# Altium schematic sheet Sheet1.SchDoc
size A; SheetNumber: 1; SheetTotal: 1
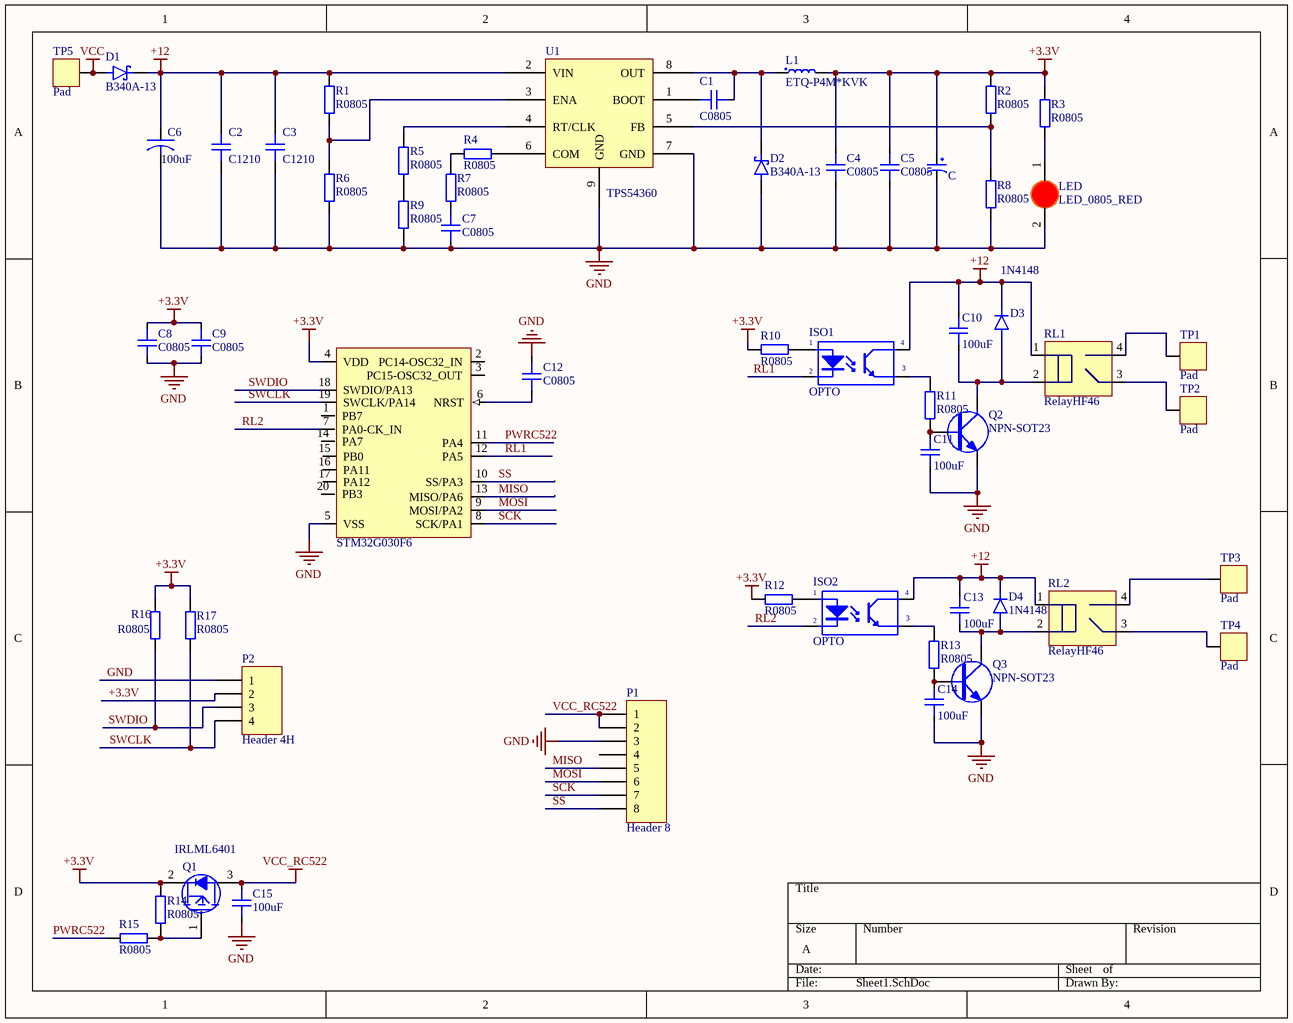
[diagram p0: Sheet1.SchDoc]

## Parts
?  STM32G030F6  [SOP65P640X120-20N]
C1  C0805  [CAP_0805]
C2  C1210  [CAP_1210]
C3  C1210  [CAP_1210]
C4  C0805  [CAP_0805]
C5  C0805  [CAP_0805]
C6  100uF  [TU HOA 1000uF/25V,50V]
C7  C0805  [CAP_0805]
C8  C0805  [CAP_0805]
C9  C0805  [CAP_0805]
C10  100uF  [CAP_0805]
C11  100uF  [CAP_0805]
C12  C0805  [CAP_0805]
C13  100uF  [CAP_0805]
C14  100uF  [CAP_0805]
C15  100uF  [CAP_0805]
D1  B340A-13  [B340A]
D2  B340A-13  [B340A]
D3  1N4148  [DIODE SMA 1]
D4  1N4148  [DIODE SMA 1]
ISO1  OPTO  [PC817 SMD]
ISO2  OPTO  [PC817 SMD]
L1  ETQ-P4M*KVK  [ind 7x7x4]
LED  LED_0805_RED  [LED-0805-Red]
P1  Header 8  [HDR1X8]
P2  Header 4H  [HDR1X4]
Q1  IRLML6401  [SOT23 - 3PIN]
Q2  NPN-SOT23  [SOT23 - 3PIN]
Q3  NPN-SOT23  [SOT23 - 3PIN]
R1  R0805  [RES_0805]
R2  R0805  [RES_0805]
R3  R0805  [RES_0805]
R4  R0805  [RES_0805]
R5  R0805  [RES_0805]
R6  R0805  [RES_0805]
R7  R0805  [RES_0805]
R8  R0805  [RES_0805]
R9  R0805  [RES_0805]
R10  R0805  [RES_0805]
R11  R0805  [RES_0805]
R12  R0805  [RES_0805]
R13  R0805  [RES_0805]
R14  R0805  [RES_0805]
R15  R0805  [RES_0805]
R16  R0805  [RES_0805]
R17  R0805  [RES_0805]
RL1  RelayHF46  [Relay 4 chan HF46F]
RL2  RelayHF46  [Relay 4 chan HF46F]
TP1  Pad  [PAD_SQ_2MM]  (no BOM)
TP2  Pad  [PAD_SQ_2MM]  (no BOM)
TP3  Pad  [PAD_SQ_2MM]  (no BOM)
TP4  Pad  [PAD_SQ_2MM]  (no BOM)
TP5  Pad  [PAD_SQ_2MM]  (no BOM)
Tụ_tantalum_7343_477C_16V_470uF_7.3x4.3mm  C  [tu tantalum smd7343]
U1  TPS54360  [TPS5430DDAR]

## Nets
+3.3V: ?.4(VDD) C4.2 C5.2 C8.2 C9.2 L1.2 P2.2 Q1.2(D) R2.2 R3.2 R10.2 R12.2 R14.1 R16.2 R17.2 Tụ_tantalum_7343_477C_16V_470uF_7.3x4.3mm.1
+12: C2.2 C3.2 C6.1 C10.2 C13.2 D1.C D3.K D4.K ISO1.4(C) ISO2.4(C) R1.2 RL1.1 RL2.1 U1.2(VIN)
GND: ?.5(VSS) C2.1 C3.1 C4.1 C5.1 C6.2 C7.1 C8.1 C9.1 C11.1 C12.1 C14.1 C15.1 D2.A LED.2(K) P1.3 P2.1 Q2.2(E) Q3.2(E) R6.1 R8.1 R9.1 Tụ_tantalum_7343_477C_16V_470uF_7.3x4.3mm.2 U1.7(GND) U1.9(GND)
VCC: D1.A TP5.1
VCC_RC522: C15.2 P1.1 P1.2 Q1.3(S)
MISO: ?.13(MISO/PA6) P1.5
MOSI: ?.9(MOSI/PA2) P1.6
PWRC522: ?.11(PA4) R15.1
RL1: ?.12(PA5) ISO1.2(K)
RL2: ?.7(PA0-CK_IN) ISO2.2(K)
SCK: ?.8(SCK/PA1) P1.7
SS: ?.10(SS/PA3) P1.8
SWCLK: ?.19(SWCLK/PA14) P2.4 R17.1
SWDIO: ?.18(SWDIO/PA13) P2.3 R16.1
Net?_6: ?.6(NRST) C12.2
NetC1_1: C1.1 D2.C L1.1 U1.8(OUT)
NetC1_2: C1.2 U1.1(BOOT)
NetC7_2: C7.2 R7.1
NetC10_1: C10.1 D3.A Q2.3(C) RL1.2
NetC11_2: C11.2 Q2.1(B) R11.1
NetC13_1: C13.1 D4.A Q3.3(C) RL2.2
NetC14_2: C14.2 Q3.1(B) R13.1
NetISO1_1: ISO1.1(A) R10.1
NetISO1_3: ISO1.3(E) R11.2
NetISO2_1: ISO2.1(A) R12.1
NetISO2_3: ISO2.3(E) R13.2
NetLED_1: LED.1(A) R3.1
NetQ1_1: Q1.1(G) R14.2 R15.2
NetR1_1: R1.1 R6.2 U1.3(ENA)
NetR2_1: R2.1 R8.2 U1.5(FB)
NetR4_1: R4.1 R7.2
NetR4_2: R4.2 U1.6(COM)
NetR5_1: R5.1 R9.2
NetR5_2: R5.2 U1.4(RT/CLK)
NetRL1_3: RL1.3(AC/DC) TP2.1
NetRL1_4: RL1.4(AC/DC) TP1.1
NetRL2_3: RL2.3(AC/DC) TP4.1
NetRL2_4: RL2.4(AC/DC) TP3.1

Not connected (* = marked no-connect by the designer): ? 1(PB7) 2(PC14-OSC32_IN) 3(PC15-OSC32_OUT) 14(PA7) 15(PB0) 16(PA11) 17(PA12) 20(PB3); P1 4

## Library data of the parts
C1 C4 C5 C7-C15 = CAP_0805: Capacitor SMD 0805; Manufacturer: *; Manufacturer Part Number: *; Distributor Link: *; LCSC: *; Rating: *; Dielectric: *
C2 C3 = CAP_1210: Capacitor SMD 1210; Manufacturer: *; Manufacturer Part Number: *; Distributor Link: *; LCSC: *; Rating: *; Dielectric: *
C6 = CAPACITOR
D1 D2 = B340A-13: Diode Schottky 40 V 3A Surface Mount SMA; MF: Diodes Inc.; Value: *; MP: B340A-13; Package: DO-214 Diodes Inc.; Availability: In Stock; Price: None; SnapEDA_Link: https://www.snapeda.com/parts/B340A-13/Diodes+Inc./view-part/?ref=snap; Check_prices: https://www.snapeda.com/parts/B340A-13/Diodes+Inc./view-part/?ref=eda; Purchase-URL: https://pricing.snapeda.com/search/part/B340A-13/?ref=eda
D3 D4 = 1N4148: DIODE, 1N4148 AMMO-BOX 5K; Diode Type: Small Signal; Voltage, Vrrm: 100V; Current, If AV: 150mA; Current, Ifsm: 2000A...; MF: Multicomp; SnapEDA_Link: https://www.snapeda.com/parts/1N4148/Multicomp/view-part/?ref=snap; Package: DO-204 Multicomp; Value: *; MP: 1N4148; Check_prices: https://www.snapeda.com/parts/1N4148/Multicomp/view-part/?ref=eda
ISO1 ISO2 = OPTO: Value: TLP5211
L1 = IND: Inductor Power SMD PCC-M0840M-LP Series; Manufacturer: Panasonic; Manufacturer Part Number: ETQ-P4M*KVK; Distributor Link: *; LCSC: *
R1-R17 = RES_0805: Resistor SMD 0805; Manufacturer: *; Manufacturer Part Number: *; Distributor Link: *; LCSC: *
RL1 RL2 = Relay 4 chan HF46F: Ten: Relay 5V5A HF46F-G 5-HS1; Ma_Hang: MH003879
TP1-TP5 = PAD_SQ_2MM: Test Point Square 2mm
Tụ_tantalum_7343_477C_16V_470uF_7.3x4.3mm = CAP 477C
P1 = Header 8: LatestRevisionDate: 17-Jul-2002; LatestRevisionNote: Re-released for DXP Platform.; Publisher: Altium Limited
P2 = Header 4H: LatestRevisionDate: 17-Jul-2002; LatestRevisionNote: Re-released for DXP Platform.; Publisher: Altium Limited